# Altium project embedded-dev-27.PrjPcb
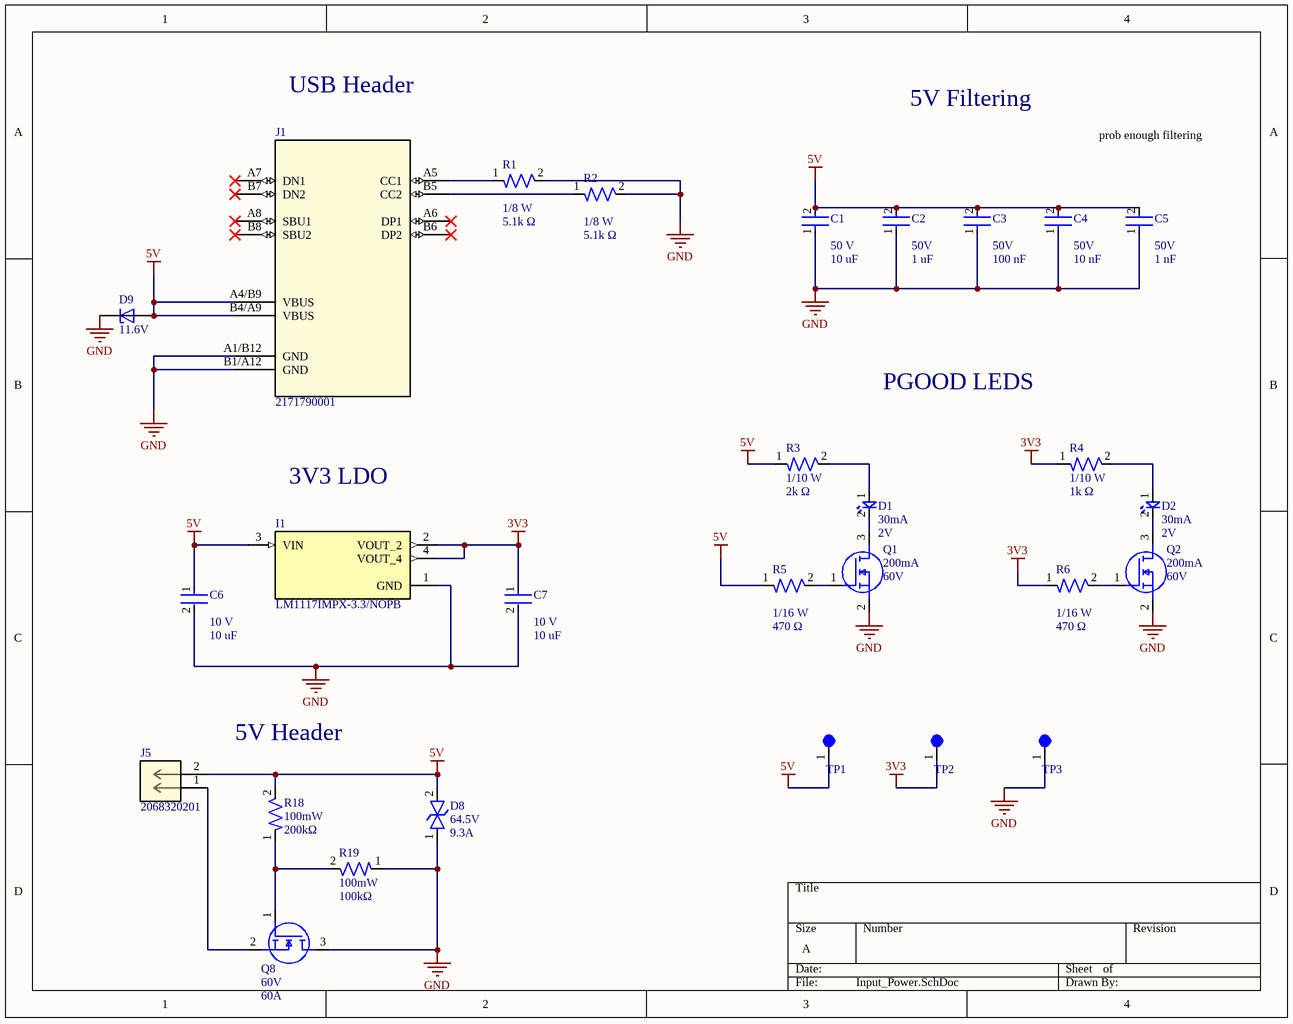
[diagram p0: Input_Power.SchDoc]
3 sheets, 68 parts. Net scope: flat (ports and power ports of the same name join across sheets).
Board file: dev_26_pcb_design_1.PcbDoc
Sheets:
  Input_Power.SchDoc
  MCU.SchDoc
  CAN.SchDoc

## Sheet Input_Power.SchDoc
size A; SheetNumber: 1; SheetTotal: 3

### Parts
C1  Voltage Rating: 50 V  Capacitance: 10 uF  [CAP-1210]  (hidden comment: CL32B106KBJNNWE)
C2  Voltage Rating: 50V  Capacitance: 1 uF  [CAP-0805]  (hidden comment: CC0805KKX7R9BB105)
C3  Voltage Rating: 50V  Capacitance: 100 nF  [CAP-0805]  (hidden comment: CC0805KRX7R9BB104)
C4  Voltage Rating: 50V  Capacitance: 10 nF  [CAP-0603]  (hidden comment: CC0603KPX7R9BB103)
C5  Voltage Rating: 50V  Capacitance: 1 nF  [CAP-0402]  (hidden comment: CC0402KRX7R9BB102)
C6  Voltage Rating: 10 V  Capacitance: 10 uF  [CAP-0603]  (hidden comment: GRM188R61A106MAALJ)
C7  Voltage Rating: 10 V  Capacitance: 10 uF  [CAP-0603]  (hidden comment: GRM188R61A106MAALJ)
D1  Forward Current: 30mA  Forward Voltage: 2V  [LED-0603]  (hidden comment: BL-HKC36G-AV-TRB)
D2  Forward Current: 30mA  Forward Voltage: 2V  [LED-0603]  (hidden comment: BL-HKC36G-AV-TRB)
D8  Voltage Rating: 64.5V  Current Rating: 9.3A  [DO-214AA (SMBJ)]  (hidden comment: SMBJ5.0A)
D9  Voltage: 11.6V  [TVS_ESDA7P60-1U1M]  (hidden comment: ESDA7P60-1U1M)
I1  LM1117IMPX-3.3/NOPB  [IC-SOT-223-4]
J1  2171790001  [2171790001_MOL]
J5  2068320201  [CONN_2068320000-SD_02_MOL]
Q1  Continuous Current: 200mA  Voltage: 60V  [IC-SOT23-3]  (hidden comment: T2N7002AK,LM)
Q2  Continuous Current: 200mA  Voltage: 60V  [IC-SOT23-3]  (hidden comment: T2N7002AK,LM)
Q8  Voltage: 60V  Continuous Current: 60A  [IC-8VSONCLIP]  (hidden comment: CSD18543Q3AT)
R1  Wattage: 1/8 W  Resistance: 5.1k Ω  [RES-0805]  (hidden comment: RC0805JR-075K1L)
R2  Wattage: 1/8 W  Resistance: 5.1k Ω  [RES-0805]  (hidden comment: RC0805JR-075K1L)
R3  Wattage: 1/10 W  Resistance: 2k Ω  [RES-0603]  (hidden comment: RC0603FR-072KL)
R4  Wattage: 1/10 W  Resistance: 1k Ω  [RES-0603]  (hidden comment: RT0603FRE131KL)
R5  Wattage: 1/16 W  Resistance: 470 Ω  [RES-0402]  (hidden comment: RC0402FR-07470RL)
R6  Wattage: 1/16 W  Resistance: 470 Ω  [RES-0402]  (hidden comment: RC0402FR-07470RL)
R18  Wattage: 100mW  Resistance: 200kΩ  [RES-0603]  (hidden comment: RC0603FR-07200KL)
R19  Wattage: 100mW  Resistance: 100kΩ  [RES-0603]  (hidden comment: RC0603FR-07100KL)
TP1  5003  [TEST-POINT-0001]  (value not drawn)
TP2  5003  [TEST-POINT-0001]  (value not drawn)
TP3  5003  [TEST-POINT-0001]  (value not drawn)

### Nets
3V3: C7.1 I1.2(VOUT_2) I1.4(VOUT_4) R4.1 R6.1 TP2.1
5V: C1.2 C2.2 C3.2 C4.2 C5.2 C6.1 D8.2 D9.2 I1.3(VIN) J1.A4/B9(VBUS) J1.B4/A9(VBUS) J5.2 R3.1 R5.1 R18.2 TP1.1
GND: C1.1 C2.1 C3.1 C4.1 C5.1 C6.2 C7.2 D8.1 D9.1 I1.1(GND) J1.A1/B12(GND) J1.B1/A12(GND) Q1.2(S) Q2.2(S) Q8.3(D) R1.2 R2.2 R19.1 TP3.1
NetD1_1: D1.1 R3.2
NetD1_2: D1.2 Q1.3(D)
NetD2_1: D2.1 R4.2
NetD2_2: D2.2 Q2.3(D)
NetJ1_A5: J1.A5(CC1) R1.1
NetJ1_B5: J1.B5(CC2) R2.1
NetJ5_1: J5.1 Q8.2(S)
NetQ1_1: Q1.1(G) R5.2
NetQ2_1: Q2.1(G) R6.2
NetQ8_1: Q8.1(G) R18.1 R19.2

Not connected (* = marked no-connect by the designer): J1 A6(DP1)* A7(DN1)* A8(SBU1)* B6(DP2)* B7(DN2)* B8(SBU2)*

### Notes on the sheet
- USB Header
- 5V Filtering
- prob enough filtering
- PGOOD LEDS
- 3V3 LDO
- 5V Header

### Library data of the parts
C1 = CAP 1210
C2 C3 = CAP 0805
C4 C6 C7 = CAP 0603
C5 = CAP 0402
D1 D2 = LED-0001: LED YELLOW CLEAR 0603 SMD; ComponentLink1Description: Datasheet; ComponentLink1URL: https://www.americanbrightled.com/pdffiles/led-components/smt/BL-HKC36G-AV-TRB.pdf
D8 = DIO-TVS-0001: TVS DIODE 40VWM 64.5VC DO214AA; ComponentLink1Description: Datasheet; ComponentLink1URL: https://www.littelfuse.com/media?resourcetype=datasheets&itemid=09a6ae9a-73cb-4ac4-acac-e6dab92ab953&filename=littelfuse_tvs_diode_smbj_datasheet.pdf
D9 = DIO-TVS-11V: TVS DIODE 5VWM 11.6VC 1610; MF: {'manufacturer': u'STMicroelectronics'}; Package: None; Price: None; Value: *; MP: ESDA7P60-1U1M; Availability: Unavailable; ComponentLink1Description: Datasheet; ComponentLink1URL: https://www.st.com/resource/en/datasheet/esda20p50-1u1m.pdf
I1 = IC_LDO_3V3_0001: IC REG LIN 3.3V 800MA SOT223-4; ComponentLink1Description: New link; ComponentLink1URL: https://www.ti.com/lit/ds/symlink/lm1117.pdf?HQS=dis-dk-null-digikeymode-dsf-pf-null-wwe&ts=1721700739746
J1 = 2171790001: Universal Serial Bus (USB) Shielded I/O Receptacle, Type C, Right-Angle, Top Mount, Surface Mount, Single Row, 16 Circuits, Gold (Au) Plating; Manufacturer_Name: Molex Connector Corporation; Copyright: Copyright (C) 2025 Ultra Librarian. All rights reserved.; Manufacturer_Part_Number: 2171790001; RefDes: RefDes; Type: Type
J5 = CONN MF+ 2 PIN VERT: Micro-Fit+ Vertical Header, Through Hole, 3.00mm Pitch, Dual Row, 2 Circuits, Tin (Sn) Plating, Glow-Wire Capable, Black, Tray; Manufacturer_Name: Molex Connector Corporation; Copyright: Copyright (C) 2025 Ultra Librarian. All rights reserved.; Manufacturer_Part_Number: 2068320201; RefDes: RefDes; Type: Type
Q1 Q2 = NMOS-200MA-0001: MOSFET N-CH 60V 200MA SOT23; ComponentLink1Description: Datasheet; ComponentLink1URL: https://toshiba.semicon-storage.com/info/T2N7002AK_datasheet_en_20150401.pdf?did=29712&prodName=T2N7002AK
Q8 = NMOS-60A-0001: MOSFET N-CH 60V 12A/60A 8VSON; ComponentLink2Description: Datasheet; ComponentLink2URL: http://www.ti.com/lit/ds/symlink/csd18543q3a.pdf
R1 R2 = RES 0805
R3 R4 R18 R19 = RES 0603
R5 R6 = RES 0402
TP1-TP3 = TEST-POINT-0001: Oranange PC Test Point, Miniature Phoisphor Bronze Silver Plating Through Hole Mounting Type

## Sheet MCU.SchDoc
size A; SheetNumber: 2; SheetTotal: 3
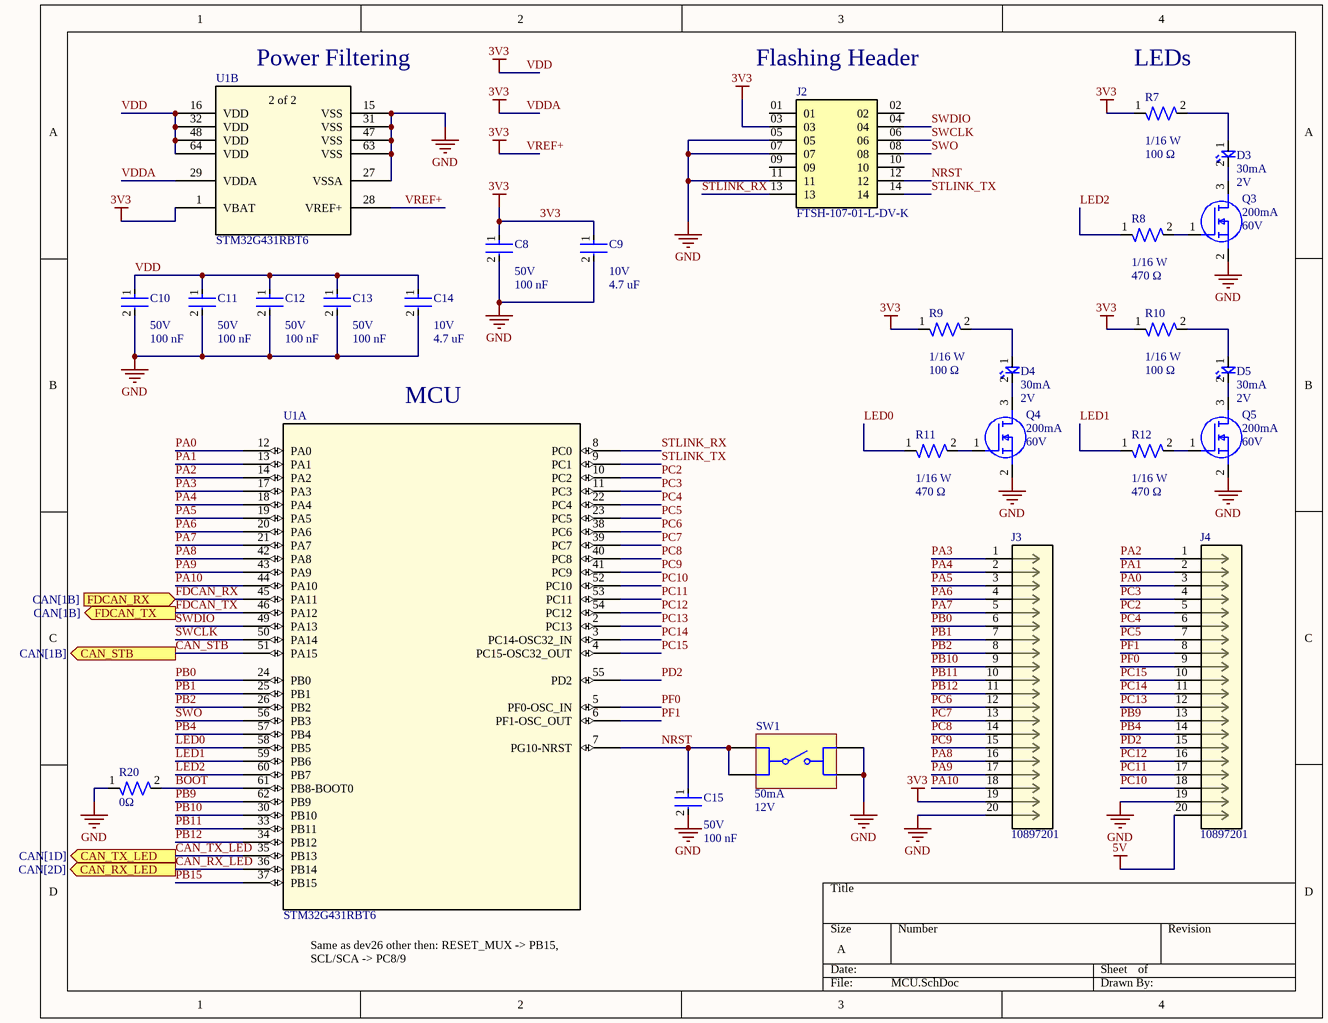
[diagram p1: MCU.SchDoc]

### Parts
C8  Voltage Rating: 50V  Capacitance: 100 nF  [CAP-0603]  (hidden comment: CC0603ZRY5V9BB104)
C9  Voltage Rating: 10V  Capacitance: 4.7 uF  [CAP-0402]  (hidden comment: GRM155R61A475MEAAD)
C10  Voltage Rating: 50V  Capacitance: 100 nF  [CAP-0603]  (hidden comment: CC0603ZRY5V9BB104)
C11  Voltage Rating: 50V  Capacitance: 100 nF  [CAP-0603]  (hidden comment: CC0603ZRY5V9BB104)
C12  Voltage Rating: 50V  Capacitance: 100 nF  [CAP-0603]  (hidden comment: CC0603ZRY5V9BB104)
C13  Voltage Rating: 50V  Capacitance: 100 nF  [CAP-0603]  (hidden comment: CC0603ZRY5V9BB104)
C14  Voltage Rating: 10V  Capacitance: 4.7 uF  [CAP-0402]  (hidden comment: GRM155R61A475MEAAD)
C15  Voltage Rating: 50V  Capacitance: 100 nF  [CAP-0603]  (hidden comment: CC0603ZRY5V9BB104)
D3  Forward Current: 30mA  Forward Voltage: 2V  [LED-0603]  (hidden comment: BL-HKC36G-AV-TRB)
D4  Forward Current: 30mA  Forward Voltage: 2V  [LED-0603]  (hidden comment: BL-HKC36G-AV-TRB)
D5  Forward Current: 30mA  Forward Voltage: 2V  [LED-0603]  (hidden comment: BL-HKC36G-AV-TRB)
J2  FTSH-107-01-L-DV-K  [SAMTEC_FTSH-107-01-L-DV-K]
J3  10897201  [CONN20_0010897201_MOL]
J4  10897201  [CONN20_0010897201_MOL]
Q3  Continuous Current: 200mA  Voltage: 60V  [IC-SOT23-3]  (hidden comment: T2N7002AK,LM)
Q4  Continuous Current: 200mA  Voltage: 60V  [IC-SOT23-3]  (hidden comment: T2N7002AK,LM)
Q5  Continuous Current: 200mA  Voltage: 60V  [IC-SOT23-3]  (hidden comment: T2N7002AK,LM)
R7  Wattage: 1/16 W  Resistance: 100 Ω  [RES-0402]  (hidden comment: RC0402FR-07100RL)
R8  Wattage: 1/16 W  Resistance: 470 Ω  [RES-0402]  (hidden comment: RC0402FR-07470RL)
R9  Wattage: 1/16 W  Resistance: 100 Ω  [RES-0402]  (hidden comment: RC0402FR-07100RL)
R10  Wattage: 1/16 W  Resistance: 100 Ω  [RES-0402]  (hidden comment: RC0402FR-07100RL)
R11  Wattage: 1/16 W  Resistance: 470 Ω  [RES-0402]  (hidden comment: RC0402FR-07470RL)
R12  Wattage: 1/16 W  Resistance: 470 Ω  [RES-0402]  (hidden comment: RC0402FR-07470RL)
R20  Resistance: 0Ω  [RES-2010]  (hidden comment: CRF2010-J/-000ELF)
SW1  Rated Current: 50mA  Rated Voltage (DC): 12V  [430182095816]  (hidden comment: 430182095816)
U1  STM32G431RBT6  [LQFP64-10x10mm]  (parts A,B of 2)

### Ports
CAN_RX_LED (out, see CAN[2D]), CAN_STB (out, see CAN[1B]), CAN_TX_LED (out, see CAN[1D]), FDCAN_RX (in, see CAN[1B]), FDCAN_TX (out, see CAN[1B])

### Nets
3V3: C8.1 C9.1 C10.1 C11.1 C12.1 C13.1 C14.1 J2.03 J3.19 R7.1 R9.1 R10.1 U1.1(VBAT) U1.16(VDD) U1.28(VREF+) U1.29(VDDA) U1.32(VDD) U1.48(VDD) U1.64(VDD)  [also labelled VDD, VDDA, VREF+]
5V: J4.20
GND: C8.2 C9.2 C10.2 C11.2 C12.2 C13.2 C14.2 C15.2 J2.05 J2.07 J2.11 J3.20 J4.19 Q3.2(S) Q4.2(S) Q5.2(S) R20.1 SW1.B1 SW1.B2 U1.15(VSS) U1.27(VSSA) U1.31(VSS) U1.47(VSS) U1.63(VSS)
BOOT: R20.2 U1.61(PB8-BOOT0)
CAN_RX_LED: U1.36(PB14) ; port CAN_RX_LED
CAN_STB: U1.51(PA15) ; port CAN_STB
CAN_TX_LED: U1.35(PB13) ; port CAN_TX_LED
FDCAN_RX: U1.45(PA11) ; port FDCAN_RX
FDCAN_TX: U1.46(PA12) ; port FDCAN_TX
LED0: R11.1 U1.58(PB5)
LED1: R12.1 U1.59(PB6)
LED2: R8.1 U1.60(PB7)
NRST: C15.1 J2.12 SW1.A1 SW1.A2 U1.7(PG10-NRST)
PA0: J4.3 U1.12(PA0)
PA1: J4.2 U1.13(PA1)
PA2: J4.1 U1.14(PA2)
PA3: J3.1 U1.17(PA3)
PA4: J3.2 U1.18(PA4)
PA5: J3.3 U1.19(PA5)
PA6: J3.4 U1.20(PA6)
PA7: J3.5 U1.21(PA7)
PA8: J3.16 U1.42(PA8)
PA9: J3.17 U1.43(PA9)
PA10: J3.18 U1.44(PA10)
PB0: J3.6 U1.24(PB0)
PB1: J3.7 U1.25(PB1)
PB2: J3.8 U1.26(PB2)
PB4: J4.14 U1.57(PB4)
PB9: J4.13 U1.62(PB9)
PB10: J3.9 U1.30(PB10)
PB11: J3.10 U1.33(PB11)
PB12: J3.11 U1.34(PB12)
PB15: U1.37(PB15)
PC2: J4.5 U1.10(PC2)
PC3: J4.4 U1.11(PC3)
PC4: J4.6 U1.22(PC4)
PC5: J4.7 U1.23(PC5)
PC6: J3.12 U1.38(PC6)
PC7: J3.13 U1.39(PC7)
PC8: J3.14 U1.40(PC8)
PC9: J3.15 U1.41(PC9)
PC10: J4.18 U1.52(PC10)
PC11: J4.17 U1.53(PC11)
PC12: J4.16 U1.54(PC12)
PC13: J4.12 U1.2(PC13)
PC14: J4.11 U1.3(PC14-OSC32_IN)
PC15: J4.10 U1.4(PC15-OSC32_OUT)
PD2: J4.15 U1.55(PD2)
PF0: J4.9 U1.5(PF0-OSC_IN)
PF1: J4.8 U1.6(PF1-OSC_OUT)
STLINK_RX: J2.13 U1.8(PC0)
STLINK_TX: J2.14 U1.9(PC1)
SWCLK: J2.06 U1.50(PA14)
SWDIO: J2.04 U1.49(PA13)
SWO: J2.08 U1.56(PB3)
NetD3_1: D3.1 R7.2
NetD3_2: D3.2 Q3.3(D)
NetD4_1: D4.1 R9.2
NetD4_2: D4.2 Q4.3(D)
NetD5_1: D5.1 R10.2
NetD5_2: D5.2 Q5.3(D)
NetQ3_1: Q3.1(G) R8.2
NetQ4_1: Q4.1(G) R11.2
NetQ5_1: Q5.1(G) R12.2

Not connected (* = marked no-connect by the designer): J2 01 02 09 10

### Notes on the sheet
- (near U1) Power Filtering
- (near J2) Flashing Header
- (near R7) LEDs
- (near U1) MCU
- Same as dev26 other then: RESET_MUX -> PB15, SCL/SCA -> PC8/9
- (in symbol IC-STM32G431RBT6, part B) 2 of 2

### Library data of the parts
C8 C10-C13 C15 = CAP 0603
C9 C14 = CAP 0402
D3-D5 = LED-0001: LED YELLOW CLEAR 0603 SMD; ComponentLink1Description: Datasheet; ComponentLink1URL: https://www.americanbrightled.com/pdffiles/led-components/smt/BL-HKC36G-AV-TRB.pdf
J2 = CONN_Flashing-0001: Connector Header Surface Mount 14 position 0.050" (1.27mm); MF: Samtec; Value: *; Price: None; Package: None; Availability: Unavailable; MP: FTSH-107-01-L-DV-K; ComponentLink1Description: Datasheet; ComponentLink1URL: https://mm.digikey.com/Volume0/opasdata/d220001/medias/docus/6209/ftsh-1xx-xx-xxx-dv-xxx-xxx-x-xx-mkt.pdf
J3 J4 = CONN-20: 2.54mm Pitch C-Grid Breakaway Header, Dual Row, Vertical, High Temperature, 20 Circuits, Tin (Sn) Plating, 2.72mm PC Tail Length; Manufacturer_Name: Molex Connector Corporation; Copyright: Copyright (C) 2025 Ultra Librarian. All rights reserved.; Manufacturer_Part_Number: 10897201; Datasheet: https://www.molex.com/en-us/products/part-detail-pdf/10897201?display=pdf; RefDes: RefDes; Type: Type
Q3-Q5 = NMOS-200MA-0001: MOSFET N-CH 60V 200MA SOT23; ComponentLink1Description: Datasheet; ComponentLink1URL: https://toshiba.semicon-storage.com/info/T2N7002AK_datasheet_en_20150401.pdf?did=29712&prodName=T2N7002AK
R7-R12 = RES 0402
R20 = RES-0-0001: 0 Ohms Jumper Chip Resistor 2010 (5025 Metric) Automotive AEC-Q200 Metal Element; Tolerance: 1%; Size: 0402; ComponentLink1Description: Datasheet; ComponentLink1URL: https://www.yageo.com/upload/media/product/products/datasheet/rchip/PYu-RC_Group_51_RoHS_L_12.pdf
SW1 = BUTTON-VERT-12V-0.5A: WS-TASV SMT Tact Switch, 6mm x 6mm, 160gf, SPST-NO, 12V, 50mA; Manufacturer: Wurth Elektronik; Washable: No; Manufacturer Part Number: 430182095816; Category: Tact Switch; Match Code: WS-TASV; ComponentLink1Description: Website Link; ComponentLink1URL: https://www.we-online.com/redexpert/article/430182095816?ad; ComponentLink2Description: Datasheet Link; ComponentLink2URL: https://www.we-online.com/redexpert/spec/430182095816?ad; Mount: Surface Mount; Min Operating Temperature: -40°C; Max Operating Temperature: 85°C; Packaging: Tape and Reel; Length: 6mm; Width: 6mm; Height: 9.5mm; Circuit: SPST-NO; Contact Material: Stainless Steel; Contact Plating: Silver; Operation Force: 160gf; Terminal Material: Copper Alloy; Terminal Plating: Silver
U1 = IC-STM32G431RBT6: Mainstream Arm Cortex-M4 MCU 170 MHz with 128 Kbytes of Flash memory, Math Accelerator, Medium Analog level integration; Manufacturer_Name: STMicroelectronics; Copyright: Copyright (C) 2025 Ultra Librarian. All rights reserved.; Manufacturer_Part_Number: STM32G431RBT6; Datasheet: https://www.st.com/resource/en/datasheet/stm32g431c6.pdf; RefDes: RefDes; Type: Type

## Sheet CAN.SchDoc
size A; SheetNumber: 3; SheetTotal: 3
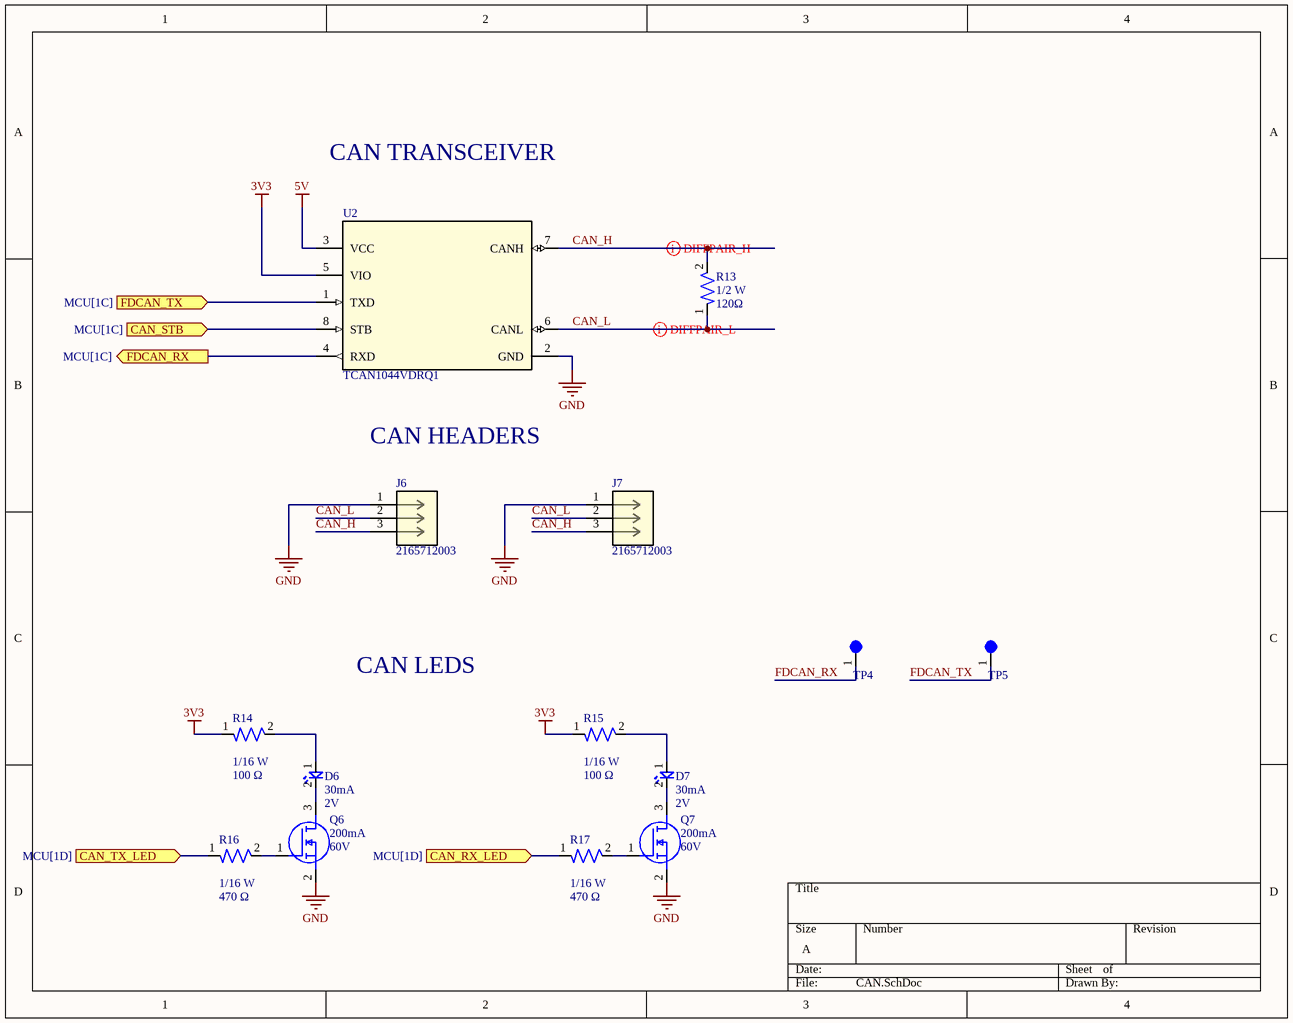
[diagram p2: CAN.SchDoc]

### Parts
D6  Forward Current: 30mA  Forward Voltage: 2V  [LED-0603]  (hidden comment: BL-HKC36G-AV-TRB)
D7  Forward Current: 30mA  Forward Voltage: 2V  [LED-0603]  (hidden comment: BL-HKC36G-AV-TRB)
J6  2165712003  [CONN_2165710003-SD_03_MOL]
J7  2165712003  [CONN_2165710003-SD_03_MOL]
Q6  Continuous Current: 200mA  Voltage: 60V  [IC-SOT23-3]  (hidden comment: T2N7002AK,LM)
Q7  Continuous Current: 200mA  Voltage: 60V  [IC-SOT23-3]  (hidden comment: T2N7002AK,LM)
R13  Wattage: 1/2 W  Resistance: 120Ω  [RES-1210]  (hidden comment: RC1210FR-07120RL)
R14  Wattage: 1/16 W  Resistance: 100 Ω  [RES-0402]  (hidden comment: RC0402FR-07100RL)
R15  Wattage: 1/16 W  Resistance: 100 Ω  [RES-0402]  (hidden comment: RC0402FR-07100RL)
R16  Wattage: 1/16 W  Resistance: 470 Ω  [RES-0402]  (hidden comment: RC0402FR-07470RL)
R17  Wattage: 1/16 W  Resistance: 470 Ω  [RES-0402]  (hidden comment: RC0402FR-07470RL)
TP4  5003  [TEST-POINT-0001]  (value not drawn)
TP5  5003  [TEST-POINT-0001]  (value not drawn)
U2  TCAN1044VDRQ1  [IC-8SOIC]

### Ports
CAN_RX_LED (in, see MCU[1D]), CAN_STB (in, see MCU[1C]), CAN_TX_LED (in, see MCU[1D]), FDCAN_RX (out, see MCU[1C]), FDCAN_TX (in, see MCU[1C])

### Nets
3V3: R14.1 R15.1 U2.5(VIO)
5V: U2.3(VCC)
GND: J6.1 J7.1 Q6.2(S) Q7.2(S) U2.2(GND)
CAN_H: J6.3 J7.3 R13.2 U2.7(CANH)
CAN_L: J6.2 J7.2 R13.1 U2.6(CANL)
CAN_RX_LED: R17.1 ; port CAN_RX_LED
CAN_STB: U2.8(STB) ; port CAN_STB
CAN_TX_LED: R16.1 ; port CAN_TX_LED
FDCAN_RX: U2.4(RXD) ; port FDCAN_RX
FDCAN_RX: TP4.1  [a separate net that carries the same name]
FDCAN_TX: U2.1(TXD) ; port FDCAN_TX
FDCAN_TX: TP5.1  [a separate net that carries the same name]
NetD6_1: D6.1 R14.2
NetD6_2: D6.2 Q6.3(D)
NetD7_1: D7.1 R15.2
NetD7_2: D7.2 Q7.3(D)
NetQ6_1: Q6.1(G) R16.2
NetQ7_1: Q7.1(G) R17.2

### Layout directives
differential pair: CAN_H, CAN_L

### Notes on the sheet
- CAN TRANSCEIVER
- CAN HEADERS
- CAN LEDS

### Library data of the parts
D6 D7 = LED-0001: LED YELLOW CLEAR 0603 SMD; ComponentLink1Description: Datasheet; ComponentLink1URL: https://www.americanbrightled.com/pdffiles/led-components/smt/BL-HKC36G-AV-TRB.pdf
J6 J7 = CONN MF+ 3 PIN VERT: Micro-Fit+ Vertical Header, Through Hole, 3.00mm Pitch, Single Row, 3 Circuits, 0.38Âµm Gold (Au) Plating, Glow-Wire Capable, Black; Manufacturer_Name: Molex Connector Corporation; Copyright: Copyright (C) 2026 Ultra Librarian. All rights reserved.; Manufacturer_Part_Number: 2165712003; RefDes: RefDes; Type: Type
Q6 Q7 = NMOS-200MA-0001: MOSFET N-CH 60V 200MA SOT23; ComponentLink1Description: Datasheet; ComponentLink1URL: https://toshiba.semicon-storage.com/info/T2N7002AK_datasheet_en_20150401.pdf?did=29712&prodName=T2N7002AK
R13 = RES CAN TERM 1210
R14-R17 = RES 0402
TP4 TP5 = TEST-POINT-0001: as TP1 on sheet Input_Power
U2 = IC-CAN-0001: IC TRANSCEIVER 1/1 8SOIC; ComponentLink1Description: Datasheet; ComponentLink1URL: https://www.ti.com/lit/ds/symlink/tcan1044-q1.pdf?HQS=dis-dk-null-digikeymode-dsf-pf-null-wwe&ts=1728758303289&ref_url=https%253A%252F%252Fwww.ti.com%252Fgeneral%252Fdocs%252Fsuppproductinfo.tsp%253FdistId%253D10%2526gotoUrl%253Dhttps%253A%252F%252Fwww.ti.com%252Flit%252Fgpn%252Ftcan1044-q1

## Nets that join several sheets
3V3: Input_Power (6 pins), MCU (19 pins), CAN (R14.1 R15.1 U2.5)
5V: Input_Power (16 pins), MCU (J4.20), CAN (U2.3)
GND: Input_Power (19 pins), MCU (24 pins), CAN (5 pins)
CAN_RX_LED: MCU (U1.36), CAN (R17.1)
CAN_STB: MCU (U1.51), CAN (U2.8)
CAN_TX_LED: MCU (U1.35), CAN (R16.1)
FDCAN_RX: MCU (U1.45), CAN (U2.4)
FDCAN_TX: MCU (U1.46), CAN (U2.1)